# EAGLE design zero-o2-eliminator (EAGLE 7.2.0)
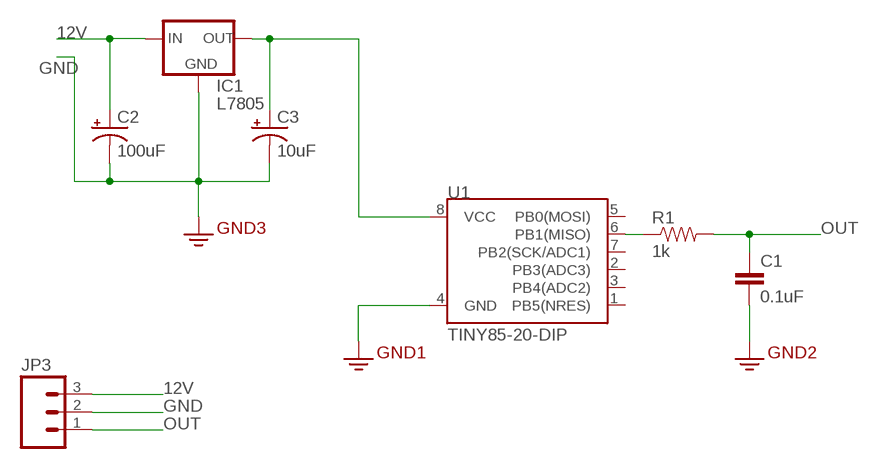
[diagram p0: schematic, sheet 1]

## Parts
C1  0.1uF  0.1UF-50V-20%(PTH)KIT-EZ  [CAP-PTH-SMALL-KIT]
C2  100uF  10UF-25V-20%(PTH)KIT  [CPOL-RADIAL-10UF-25V-KIT]
C3  10uF  10UF-25V-20%(PTH)KIT  [CPOL-RADIAL-10UF-25V-KIT]
IC1  L7805  V_REG_78XXSIDE  [78XXL]
JP3  M03SCREW  [SCREWTERMINAL-3.5MM-3]
R1  1k  1KOHM-1/4W-5%(PTH)VERT-KIT  [AXIAL-0.1EZ]
U1  TINY85-20-DIP  ATTINY45TINY85-20-DIP  [DIP08]

## Nets
12V: C2.1(+) IC1.IN JP3.3
GND: C1.2 C2.2(-) C3.2(-) IC1.GND JP3.2 U1.4(GND) ; supply symbol labelled GND2
N$1: R1.P$1 U1.6(PB1(MISO))
N$4: C3.1(+) IC1.OUT U1.8(VCC)
OUT: C1.1 JP3.1 R1.P$2
Unconnected: U1.1(PB5(NRES)) U1.2(PB3(ADC3)) U1.3(PB4(ADC2)) U1.5(PB0(MOSI)) U1.7(PB2(SCK/ADC1))

## Library data of the parts
C1 = SparkFun-Capacitors:0.1UF-50V-20%(PTH): CAP-08370; PROD_ID: CAP-08370
C2 C3 = SparkFun-Capacitors:10UF-25V-20%(PTH): CAP-08440; PROD_ID: CAP-08440
IC1 = SparkFun-PowerIC:V_REG_78XX: Voltage Regulator Standard 7805 5V regulator. IGO (Input Ground Output). Spark Fun Electronics SKU : COM-00107
JP3 = SparkFun-Connectors:M03: Header 3 Standard 3-pin 0.1" header. Use with straight break away headers (SKU : PRT-00116), right angle break away headers (PRT-00553), swiss pins (PRT-00743), machine pins (PRT-00117), and female headers (PRT-00115). Molex polarized connector foot print use with SKU : PRT-08232 with associated crimp pins and housings.
R1 = SparkFun-Resistors:1KOHM-1/4W-5%(PTH): RES-08380; PROD_ID: RES-08380
U1 = SparkFun-DigitalIC:ATTINY45: Atmel 8-pin 2/4/8kB flash uC; PROD_ID: IC-09445

## Board
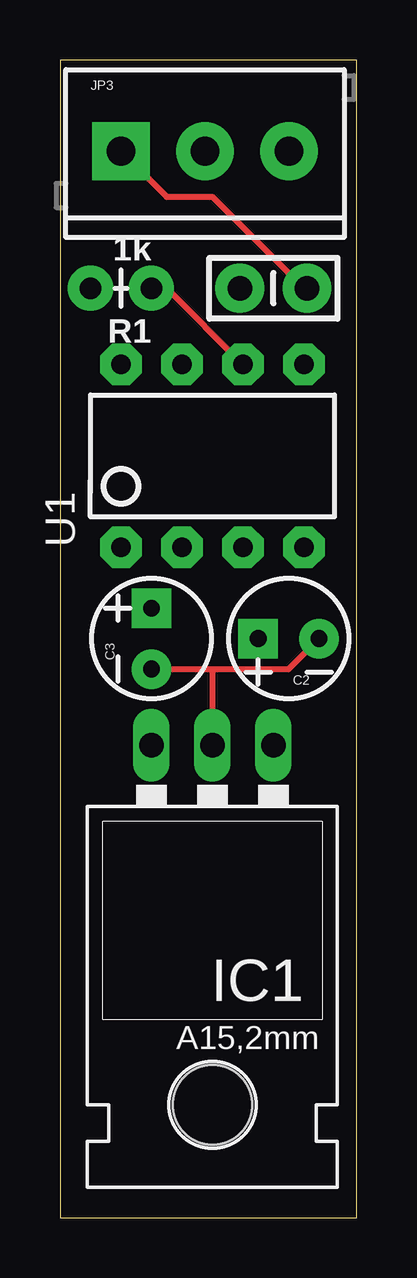
[diagram p1: board, top side]
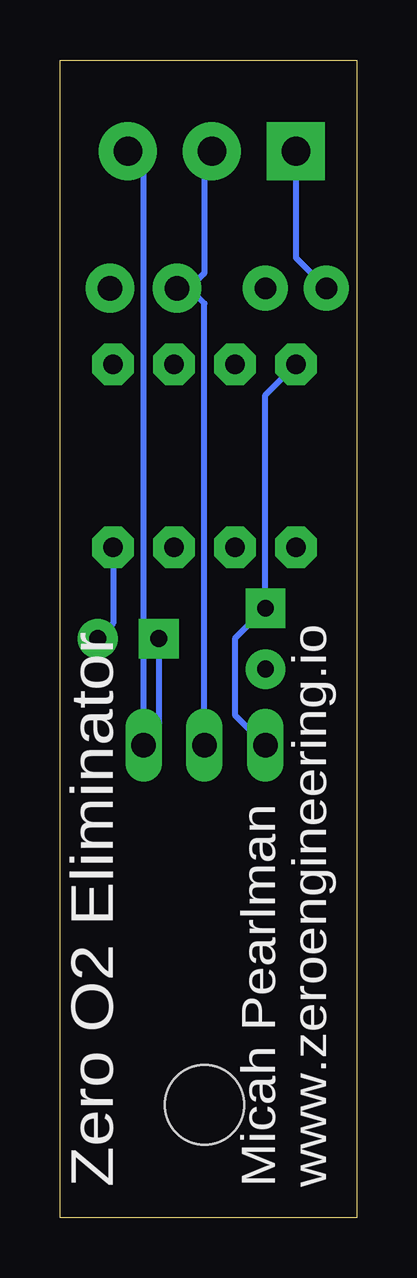
[diagram p2: board, bottom side, seen from below]

Size 12.37 x 48.25 mm. Coordinates in mm from the lower left corner, seen from the top.
Outline: 0,0 12.37,0 12.37,48.25 0,48.25 0,0
Copper layers (1*16): Top 0.035mm / dielectric 1.5mm / Bottom 0.035mm
Design rules "default": minimum track width 10mil, minimum drill 24mil, track to track 8mil, track to pad 8mil, pad to pad 8mil, via to via 8mil, smd to smd 8mil, copper to edge 40mil, drill to drill 8mil, minimum pad ring 10mil, minimum via ring 8mil, stop-mask expansion 4mil, vias tented up to drill 0mil, thermal gap 10mil

### Footprints (pad centres in the part's own frame; a part is rotated, then mirrored left to right if it is on the bottom)
CAP-PTH-SMALL-KIT = drill 1.016 pad 2.032: 1 -1.397,0; 2 1.397,0
CPOL-RADIAL-10UF-25V-KIT = drill 0.7 pad 1.651 square: 1 1.27,0 | drill 0.7 pad 1.651: 2 -1.27,0
78XXL = drill 1.016 long: GND 0,-3.81; IN -2.54,-3.81; OUT 2.54,-3.81 | hole 3.302: 0,11.176
SCREWTERMINAL-3.5MM-3 = drill 1.2 pad 2.413 square: 1 0,0 | drill 1.2 pad 2.413: 2 3.5,0; 3 7,0
AXIAL-0.1EZ = drill 0.9 pad 1.88: P$1 0,0; P$2 2.54,0
DIP08 = drill 0.813 pad 1.727 octagon: 1 -3.81,-3.81; 2 -1.27,-3.81; 3 1.27,-3.81; 4 3.81,-3.81; 5 3.81,3.81; 6 1.27,3.81; 7 -1.27,3.81; 8 -3.81,3.81

### Placement (x,y rotation side)
C1  8.89,38.73 180 top
C2  9.53,24.13 180 top
C3  3.81,24.13 90 top
IC1  6.35,15.88 180 top
JP3  2.54,44.45 0 top
R1  3.81,38.73 180 top
U1  6.35,31.75 0 top

### Tracks (layer width: path | path; a pad name or v marks a point on that pad's centre or on a via)
12V
  Bottom 0.254: C2.1 8.26,20.32 IC1.IN 8.89,43.81 9.53,44.45 JP3.3
GND
  Top 0.254: 6.35,22.86 IC1.GND | C3.2 6.35,22.86 | C2.2 9.53,22.86 6.35,22.86
  Bottom 0.254: 6.99,38.73 6.35,39.37 6.35,44.45 JP3.2 | C2.2 10.16,24.77 U1.4 | 6.99,38.73 6.35,38.1 IC1.GND | 6.99,38.73 C1.2
N$1
  Top 0.254: U1.6 4.45,38.73 R1.P$1
N$4
  Bottom 0.254: IC1.OUT 5.08,20.95 5.08,24.13 C3.1 3.81,34.29 U1.8
OUT
  Top 0.254: JP3.1 4.45,42.55 6.35,42.55 10.16,38.73 C1.1
  Bottom 0.254: R1.P$2 2.54,40.01 JP3.1

### Text on the board
_bsilk: Micah Pearlman / www.zeroengineering.io | Zero O2 Eliminator